# Altium schematic sheet Connectors.SchDoc
size A
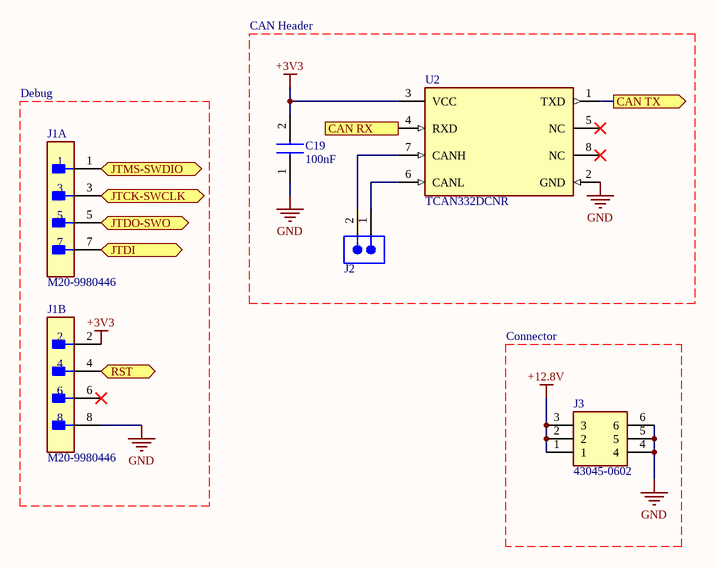
[diagram p0: Connectors.SchDoc]

## Parts
C19  100nF  [C1206]
J1  M20-9980446  [FP-M20-9980446-MFG]  (parts A,B of 2)
J2  679302124022  [679302124022]  (value not drawn)
J3  43045-0602  [43045-06(00,01,02,10)]
U2  TCAN332DCNR  [FP-DCN0008A-IPC_A]

## Ports
CAN RX (in), CAN TX (out), JTCK-SWCLK (bidir), JTDI (bidir), JTDO-SWO (bidir), JTMS-SWDIO (bidir), RST (bidir)

## Nets
+3V3: C19.2 J1.2 U2.3(VCC)
+12.8V: J3.1 J3.2 J3.3
GND: C19.1 J1.8 J3.4 J3.5 J3.6 U2.2(GND)
CAN RX: U2.4(RXD) ; port CAN RX
CAN TX: U2.1(TXD) ; port CAN TX
JTCK-SWCLK: J1.3 ; port JTCK-SWCLK
JTDI: J1.7 ; port JTDI
JTDO-SWO: J1.5 ; port JTDO-SWO
JTMS-SWDIO: J1.1 ; port JTMS-SWDIO
RST: J1.4 ; port RST
NetJ2_1: J2.1 U2.6(CANL)
NetJ2_2: J2.2 U2.7(CANH)

Not connected (* = marked no-connect by the designer): J1 6*; U2 5(NC)* 8(NC)*

## Notes on the sheet
- CAN Header
- Debug
- Connector

## Library data of the parts
C19 = C1206C104K5RACTU: Capacitor; Manufacturer_Name: KEMET; Datasheet Link: https://content.kemet.com/datasheets/KEM_C1002_X7R_SMD.pdf; Manufacturer_Part_Number: C1206C104K5RACTU; Mouser Part Number: 80-C1206C104K5R; Mouser Price/Stock: https://www.mouser.co.uk/ProductDetail/KEMET/C1206C104K5RACTU?qs=VbFpUC1cecnmBMAUeCQCPw%3D%3D; Arrow Part Number: C1206C104K5RACTU; Arrow Price/Stock: https://www.arrow.com/en/products/c1206c104k5ractu/kemet-corporation?region=nac
J1 = CMP-15831-000088-1: CONN HEADER VERT 8POS 2.54MM; Row Spacing: 0.1inch; Current Rating: 3A; Mated Stacking Heights: 16.54mm; Insulation Resistance: 10GR; Connector Type: Male Pin; Gender: Male; Number of Contacts: 8; Contact Resistance: 30mR; Contact Material: Brass; Series: M20; Max Operating Temperature: 105°C; REACH SVHC: No SVHC; Flammability Rating: UL94 V-0; Number of Rows: 2; Mount: Through Hole; Contact Plating: Tin; Min Operating Temperature: -40°C; Packaging: Bulk; Radiation Hardening: No; Insulation Material: Nylon; Orientation: Straight; Contact Shape: Square; Max Current Rating: 3A; Contact Type: Male Pin; Depth: 5.08mm; Color: Black; Contact Finish - Mating: TIN; Length: 10.16mm; Housing Color: Black; Package Quantity: 1000; Pitch: 2.54mm; Contact Mating Length: 0.24inch; Termination: Solder; Housing Material: Nylon; Fastening Type: Pull; Insulation Color: Black; Number of Positions: 8; RoHS Compliant: Yes
J2 = CMP-1502-00721-2: NexarPartId: 18818281; Number of Positions: 2; Connector Type: Male Pin; Contact Resistance: 20mΩ; Operating Supply Voltage: 50V; Insulation: Insulated; Gender: Male; Pitch: 1.5mm; Insulation Resistance: 100MΩ; Current Rating: 1A; Flammability Rating: UL94 V-0; Contact Gender: Male; Orientation: Vertical; Color: Beige, White; Termination: SMD/SMT; Length: 6mm; Width: 6mm; Packaging: Tape and Reel; Contact Material: Copper; Contact Plating: Tin; Mount: Surface Mount; Max Operating Temperature: 85°C; Number of Pins: 2; Voltage Rating: 50V; Housing Material: Nylon; Number of Contacts: 2; Number of Rows: 1; Height: 5mm; Lead Pitch: 1.5mm; REACH SVHC: Unknown; RoHS: Compliant; Min Operating Temperature: -25°C
J3 = 43045-0602: Connector; Manufacturer_Name: Molex; Datasheet Link: https://www.molex.com/pdm_docs/sd/430450200_sd.pdf; Height: 9.9mm; Manufacturer_Part_Number: 43045-0602; Mouser Part Number: 538-43045-0602; Mouser Price/Stock: https://www.mouser.co.uk/ProductDetail/Molex/43045-0602?qs=mrPiglD9aYLv9OehwOZTng%3D%3D
U2 = CMP-04872-000203-1: IC TRANSCEIVER 1/1 SOT23-8; Receiver Hysteresis: 120mV; Packaging: Tape and Reel; Mount: Surface Mount; RoHS Compliant: Yes; Min Operating Temperature: -40°C; Case/Package: SOT-23-8; Lead Free: Lead Free; Max Operating Temperature: 125°C